# Altium schematic sheet Analog Input.SchDoc
size 297 x 209 mm; CompanyName: Sainsbury Wellcome Centre; Organization: FabLab; Address1: Sainsbury Wellcome Centre; Address2: 25 Howland Street; Address3: London; Address4: W1T 4JG; DocumentNumber: 5; SheetNumber: 5; SheetTotal: 12; swcgroup: FabLab; Org: Sainsbury Wellcome Centre; Add1: 25 Howland Street; Add2: London; Add3: W1T 4JG; WebAddress: www.sainsburywellcome.org; SheetSize: A4; SheetName: Analog Input A
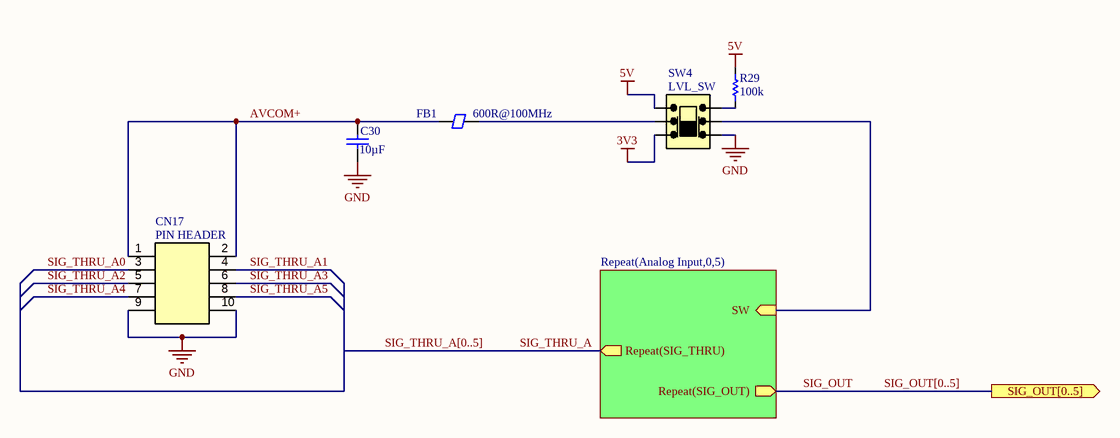
[diagram p0: Analog Input.SchDoc]

## Parts
C30  value 10µF  [CAP_CHIP_0603]  (hidden comment: C0603-10uF-35V)
CN17  PIN HEADER  [PIN_2.54_2X5P]
FB1  value 600R@100MHz  [FB_CHIP_0603]  (hidden comment: FB0603-600R-0.2A)
R29  value 100k  [RES_CHIP_0603]  (hidden comment: R0603-100K)
SW4  LVL_SW  [SW_SLIDE_OS202013MT8]

## Sub-sheets
Repeat(Analog Input,0,5) = Analog Input Connector.SchDoc: SW (in), Repeat(SIG_OUT) (out), Repeat(SIG_THRU) (out)

## Ports
SIG_OUT[0..5] (out)

## Nets
3V3: SW4.4(NCB)
5V: R29.2 SW4.6(NOB)
GND: C30.1 CN17.9 CN17.10 SW4.1(NCA)
AVCOM+: C30.2 CN17.1 CN17.2 FB1.2
SIG_OUT: sheet Repeat(Analog Input,0,5)/Repeat(SIG_OUT)
SIG_THRU_A: sheet Repeat(Analog Input,0,5)/Repeat(SIG_THRU)
SIG_THRU_A0: CN17.3
SIG_THRU_A1: CN17.4
SIG_THRU_A2: CN17.5
SIG_THRU_A3: CN17.6
SIG_THRU_A4: CN17.7
SIG_THRU_A5: CN17.8
NetFB1_1: FB1.1 SW4.5(COMB)
NetR29_1: R29.1 SW4.3(NOA)
NetSW4_2: SW4.2(COMA) ; sheet Repeat(Analog Input,0,5)/SW

## Buses and harness runs
bus SIG_OUT[0..5] = port SIG_OUT[0..5]
bus SIG_THRU_A[0..5]

## Notes on the sheet
- FILE
- VARIANT
- DATE
- REVISION
- SHEET
- /
- PROJECT
- SIZE

## Library data of the parts
C30 = CMP-611-0048-3: Ceramic Capacitor, Multilayer, Ceramic, 35V, 20% +Tol, 20% -Tol, X5R, 15% TC, 10uF, Surface Mount, 0603; PartNumber: GRM188R6YA106MA73D; Pick&PlaceFootprint: C0603; Dielectric: X5R; Capacitor Type: Ceramic; Mount: SMD; LCSC Part N.: C194427; RoHS: Yes; Tolerance: 20%; Voltage Rating: 35V; Case/Package: 0603
CN17 = CMP-380-0034-5: Straight Policy 2.5mm 6mm -40℃~+105℃ 3mm 2.54mm Double Row Black Brass 2.54mm Plugin,P=2.54mm Pin Headers; PartNumber: PZ254V-12-10P; Number of Positions: 5; Number of Contacts: 10; Gender: Male; Orientation: Straight; Pitch: 2.54mm; LCSC Part N.: C492422; Number of Rows: 2; Mount: Through Hole
FB1 = CMP-600-0001-6: Ferrite Chip, 1 Function(s), 0.2A, 2 Pin(s); PartNumber: GZ1608D601TF; Current Rating: 200mA; DC Resistance-Max: 450mR; Footprint: 0603; LCSC Part N.: C1002
R29 = CMP-633-0000-28: 100mW Thick Film Resistors 75V ±100ppm/℃ ±1% 0603 Chip Resistor; PartNumber: 0603WAF1003T5E; Number of Resistors: 1; Pick&PlaceFootprint: R0603; LCSC Part N.: C25803; Mount: Surface Mount; Voltage Rating: 75V; Power Rating: 100mW; Case/Package: 0603; Tolerance: 1%
SW4 = CMP-B00-0028-1: Switch Slide ON ON DPDT Top Slide 0.3A 30VDC 10000Cycles PC Pins Thru-Hole Bulk; PartNumber: OS202013MT8QN1; Switch Travel: 3.2mm; Switch Function: On-On; Voltage Rating (DC): 30V; Throw Configuration: DPDT; Orientation: Straight; LCSC Part N.: C2799227